# EAGLE design controller_board_minimal (EAGLE 9.0.0)
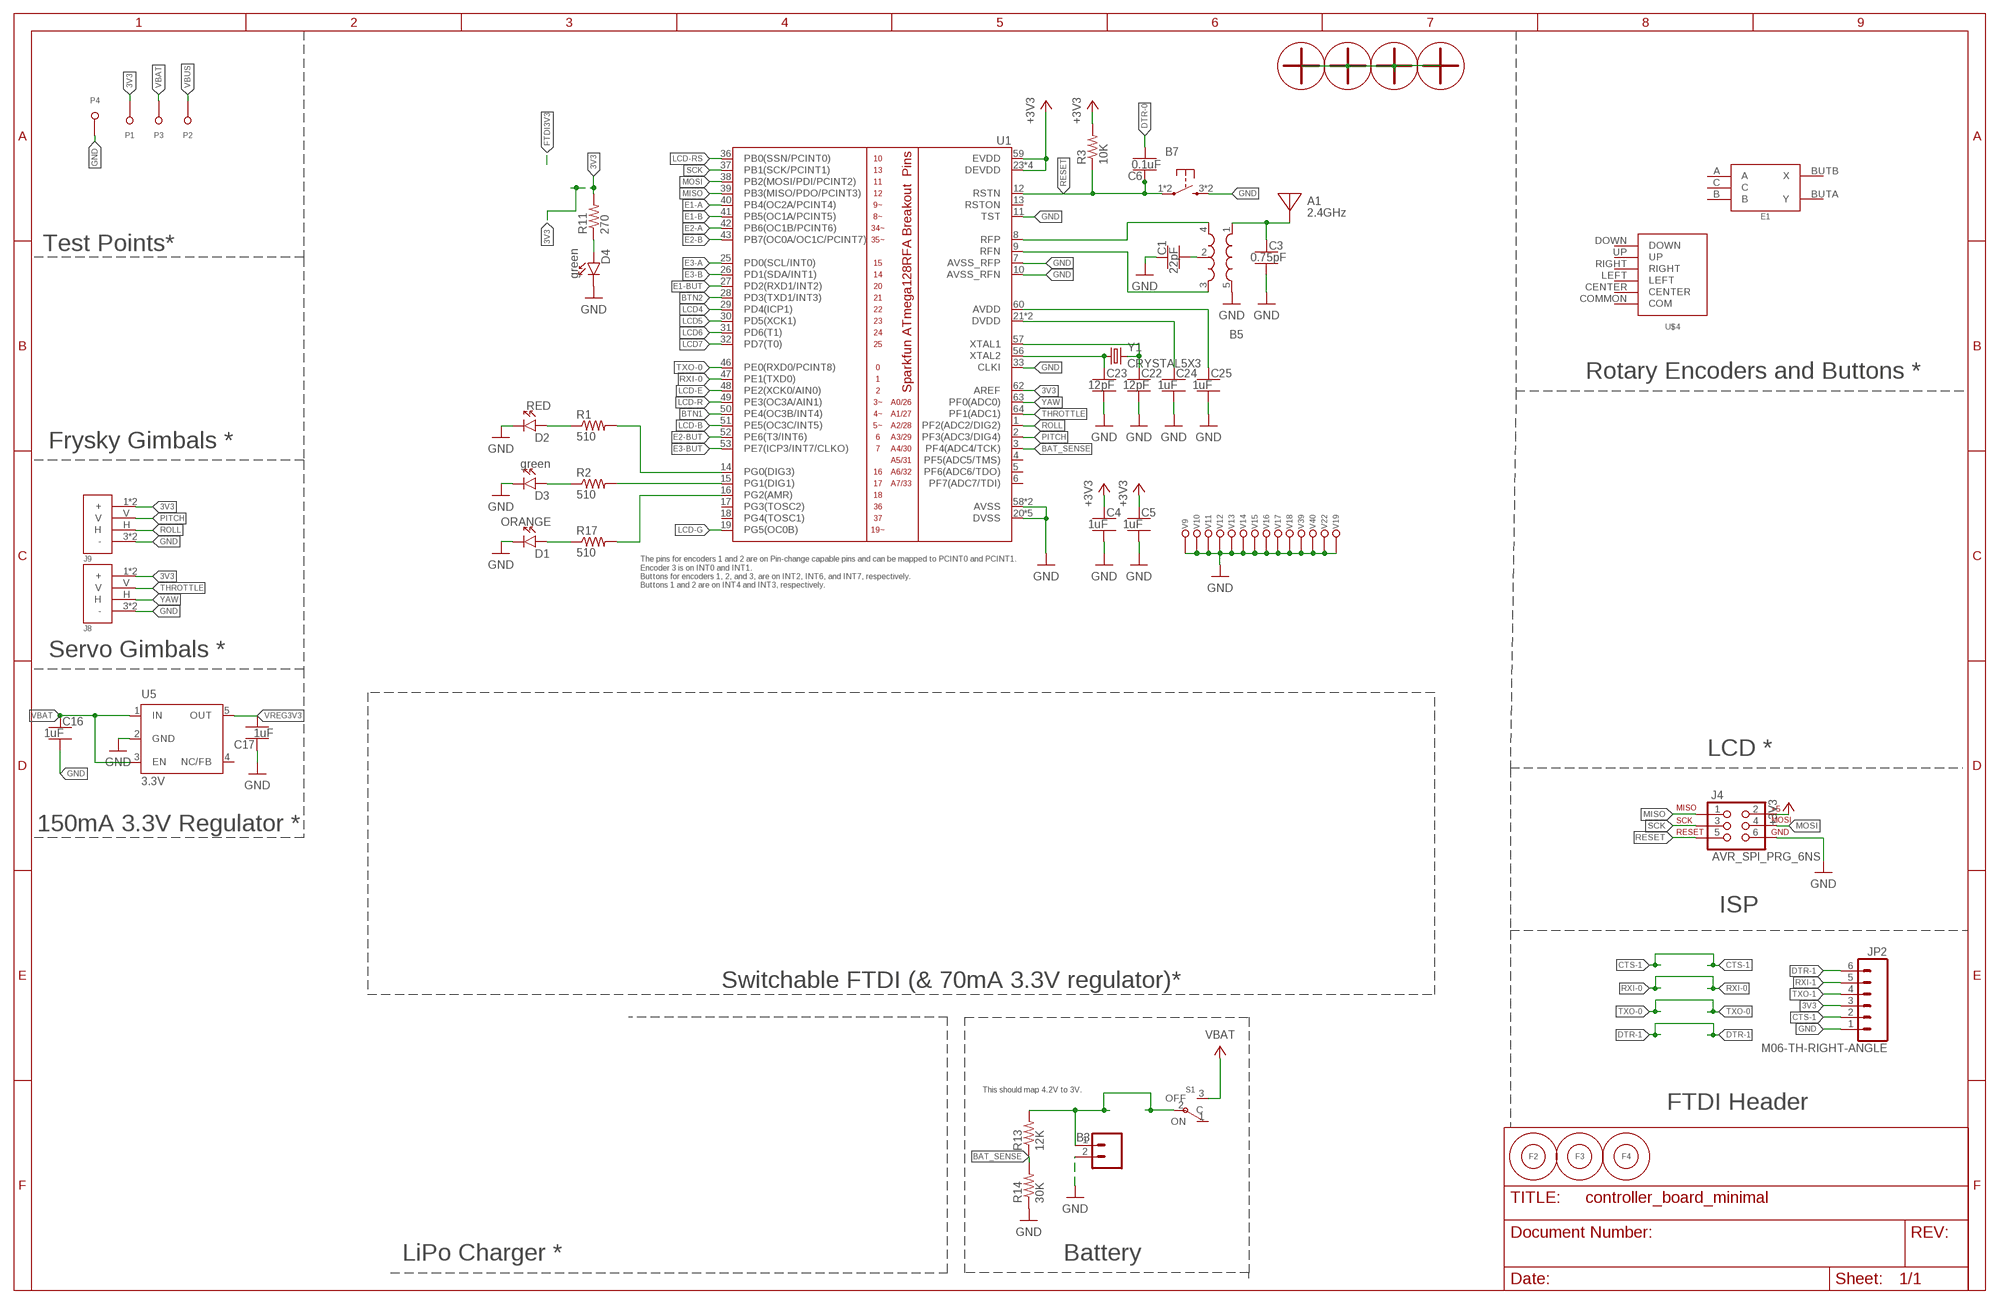
[diagram p0: schematic, sheet 1]
FRAME1 (FRAME_B_L): CREATOR: Unknown; DIST: Unknown; DISTPN: Unknown

## Parts
A1  2.4GHz  ANTENNA_PCBNRF8001_1.6MM  [ANT_PCB_2.4GHZ_NRF8001_1.6MM_1OZ]
B3  HEADER-0.1IN-2POS-SCREW  [SCREW-TERMINAL-1X2-2.54MM]
B5  BALUN0805  [BALUN]
B7  PUSHBUTTON_SMD-VERTICAL-1  [TE_FSM8JSMA_HS]
C1  22pF  CAPACITOR-NP_SMD-2012-0805_CERAMIC-22PF  [CAPC2012X140_HS]
C3  0.75pF  CAPACITOR-NP_SMD-2012-0805_CERAMIC-0.75PF  [CAPC2012X140_HS]
C4  1uF  CAPACITOR-NP_SMD-2012-0805_CERAMIC-1UF  [CAPC2012X140_HS]
C5  1uF  CAPACITOR-NP_SMD-2012-0805_CERAMIC-1UF  [CAPC2012X140_HS]
C6  0.1uF  CAPACITOR-NP_SMD-2012-0805_CERAMIC-0.1UF  [CAPC2012X140_HS]
C16  1uF  CAPACITOR-NP_SMD-2012-0805_CERAMIC-1UF  [CAPC2012X140_HS]
C17  1uF  CAPACITOR-NP_SMD-2012-0805_CERAMIC-1UF  [CAPC2012X140_HS]
C22  12pF  CAPACITOR-NP_SMD-2012-0805_CERAMIC-12PF  [CAPC2012X140_HS]
C23  12pF  CAPACITOR-NP_SMD-2012-0805_CERAMIC-12PF  [CAPC2012X140_HS]
C24  1uF  CAPACITOR-NP_SMD-2012-0805_CERAMIC-1UF  [CAPC2012X140_HS]
C25  1uF  CAPACITOR-NP_SMD-2012-0805_CERAMIC-1UF  [CAPC2012X140_HS]
D1  ORANGE  DIODE-LED_SMD-2012-0805-ORANGE  [LEDSC125X200X120-2_HS]
D2  RED  DIODE-LED_SMD-2012-0805-RED  [LEDSC125X200X120-2_HS]
D3  green  DIODE-LED_SMD-2012-0805-GREEN  [LEDSC125X200X120-2_HS]
D4  green  DIODE-LED_SMD-2012-0805-GREEN  [LEDSC125X200X120-2_HS]
E1  ROTARY-ENCODER-W/BUTTON-BOURNS-PEC12R-30MM  [BOURNS-PEC12R]
F2  1mm  FIDUCIAL-STENCIL  [FIDUCIAL_STENCIL]
F3  1mm  FIDUCIAL-STENCIL  [FIDUCIAL_STENCIL]
F4  1mm  FIDUCIAL-STENCIL  [FIDUCIAL_STENCIL]
J4  AVR_SPI_PRG_6NS  [2X3-NS]
J8  FRSKY-GIMBAL-2X-SERVO  [2X-GIMBAL-SERVO]
J9  FRSKY-GIMBAL-2X-SERVO  [2X-GIMBAL-SERVO]
JP2  M06-TH-RIGHT-ANGLE  [1X06-SIP-RIGHT-ANGLE]
P1  TEST-POINT  [TEST-POINT-KEYSTONE-5000]
P2  TEST-POINT  [TEST-POINT-KEYSTONE-5000]
P3  TEST-POINT  [TEST-POINT-KEYSTONE-5000]
P4  TEST-POINT  [TEST-POINT-KEYSTONE-5000]
R1  510  RESISTOR_SMD-2012-0805-510  [RESC2012X60_HS]
R2  510  RESISTOR_SMD-2012-0805-510  [RESC2012X60_HS]
R3  10K  RESISTOR_SMD-2012-0805-10K  [RESC2012X60_HS]
R11  270  RESISTOR_SMD-2012-0805-270  [RESC2012X60_HS]
R13  12K  RESISTOR_SMD-2012-0805-12K  [RESC2012X60_HS]
R14  30K  RESISTOR_SMD-2012-0805-30K  [RESC2012X60_HS]
R17  510  RESISTOR_SMD-2012-0805-510  [RESC2012X60_HS]
S1  POWER-SWITCH-MFS201N-9-Z-SMD-VERTICAL  [JS102011JCQN]
U1  ATMEGA128RFA1  [QFN-64]
U5  3.3V  TPS73633-DBVT3V3  [SOT23-DBV]
U$1  MOUNTING-HOLE-M2.5-GROUNDED  [M2.5-MOUNTING-HOLE]
U$2  MOUNTING-HOLE-M2.5-GROUNDED  [M2.5-MOUNTING-HOLE]
U$3  MOUNTING-HOLE-M2.5-GROUNDED  [M2.5-MOUNTING-HOLE]
U$4  NAV-SWITCH  [NAV-SWITCH-JS5208]
U$6  MOUNTING-HOLE-M2.5-GROUNDED  [M2.5-MOUNTING-HOLE]
V9  LOCKED-VIA-0.2  [VIA-0.2MM]
V10  LOCKED-VIA-0.2  [VIA-0.2MM]
V11  LOCKED-VIA-0.2  [VIA-0.2MM]
V12  LOCKED-VIA-0.2  [VIA-0.2MM]
V13  LOCKED-VIA-0.2  [VIA-0.2MM]
V14  LOCKED-VIA-0.2  [VIA-0.2MM]
V15  LOCKED-VIA-0.2  [VIA-0.2MM]
V16  LOCKED-VIA-0.2  [VIA-0.2MM]
V17  LOCKED-VIA-0.2  [VIA-0.2MM]
V18  LOCKED-VIA-0.2  [VIA-0.2MM]
V19  LOCKED-VIA-0.2  [VIA-0.2MM]
V22  LOCKED-VIA-0.2  [VIA-0.2MM]
V39  LOCKED-VIA-0.2  [VIA-0.2MM]
V40  LOCKED-VIA-0.2  [VIA-0.2MM]
Y1  CRYSTAL5X3  [CRYSTAL-SMD-5X3]

## Nets
3V3 [HIGH-I]: C4.1 C5.1 J4.2 J8.1(+) J8.4(+) J9.1(+) J9.4(+) JP2.3 P1.T R3.2 R11.2 U1.23(DEVDD) U1.34(DEVDD) U1.44(DEVDD) U1.54(DEVDD) U1.59(EVDD) U1.62(AREF) ; supply symbol labelled +3V3
ANTENNA [RFSIG]: A1.FEED B5.1(IN) C3.1
BAT_SENSE: R13.1 R14.2 U1.3(PF4(ADC4/TCK))
BPOS [HIGH-I]: B3.1 R13.2 S1.2(C)
BTN1: U1.50(PE4(OC3B/INT4))
BTN2: U1.28(PD3(TXD1/INT3))
CTS-1: JP2.2
DTR-0: C6.2
DTR-1: JP2.6
E1-A: U1.40(PB4(OC2A/PCINT4))
E1-B: U1.41(PB5(OC1A/PCINT5))
E1-BUT: U1.27(PD2(RXD1/INT2))
E2-A: U1.42(PB6(OC1B/PCINT6))
E2-B: U1.43(PB7(OC0A/OC1C/PCINT7))
E2-BUT: U1.52(PE6(T3/INT6))
E3-A: U1.25(PD0(SCL/INT0))
E3-B: U1.26(PD1(SDA/INT1))
E3-BUT: U1.53(PE7(ICP3/INT7/CLKO))
GND [HIGH-I]: B3.2 B5.5(GND) B7.3 B7.4 C1.1 C3.2 C4.2 C5.2 C16.2 C17.1 C22.2 C23.2 C24.2 C25.2 D1.1(C) D2.2(C) D3.1(C) D4.1(C) J4.6 J8.3(-) J8.6(-) J9.3(-) J9.6(-) JP2.1 P4.T R14.1 U1.7(AVSS_RFP) U1.10(AVSS_RFN) U1.11(TST) U1.20(DVSS) U1.24(DVSS) U1.33(CLKI) U1.35(DVSS) U1.45(DVSS) U1.55(DVSS) U1.58(AVSS) U1.61(AVSS) U5.2(GND) U$1.P$1 U$1.P$2 U$1.P$3 U$1.P$4 U$1.P$6 U$1.P$7 U$1.P$8 U$1.P$9 U$2.P$1 U$2.P$2 U$2.P$3 U$2.P$4 U$2.P$6 U$2.P$7 U$2.P$8 U$2.P$9 U$6.P$1 U$6.P$2 U$6.P$3 U$6.P$4 U$6.P$6 U$6.P$7 U$6.P$8 U$6.P$9 V9.P1(N) V10.P1(N) V11.P1(N) V12.P1(N) V13.P1(N) V14.P1(N) V15.P1(N) V16.P1(N) V17.P1(N) V18.P1(N) V19.P1(N) V22.P1(N) V39.P1(N) V40.P1(N)
LCD4: U1.29(PD4(ICP1))
LCD5: U1.30(PD5(XCK1))
LCD6: U1.31(PD6(T1))
LCD7: U1.32(PD7(T0))
LCD-B: U1.51(PE5(OC3C/INT5))
LCD-E: U1.48(PE2(XCK0/AIN0))
LCD-G: U1.19(PG5(OC0B))
LCD-R: U1.49(PE3(OC3A/AIN1))
LCD-RS: U1.36(PB0(SSN/PCINT0))
MISO: J4.1 U1.39(PB3(MISO/PDO/PCINT3))
MOSI: J4.4 U1.38(PB2(MOSI/PDI/PCINT2))
N$1: D1.2(A) R17.1
N$4: R2.2 U1.15(PG1(DIG1))
N$7: B5.2(GND) C1.2
N$8: R1.2 U1.14(PG0(DIG3))
N$9: D2.1(A) R1.1
N$10: D3.2(A) R2.1
N$14: D4.2(A) R11.1
N$15: C22.1 U1.57(XTAL1) Y1.3
N$16: R17.2 U1.16(PG2(AMR))
N$19: C23.1 U1.56(XTAL2) Y1.1
N$20: C24.1 U1.21(DVDD) U1.22(DVDD)
N$21: C25.1 U1.60(AVDD)
PITCH: J9.V U1.2(PF3(ADC3/DIG4))
RESET: B7.1 B7.2 C6.1 J4.5 R3.1 U1.12(RSTN)
RFN: B5.3(OUT2) U1.9(RFN)
RFP: B5.4(OUT1) U1.8(RFP)
ROLL: J9.H U1.1(PF2(ADC2/DIG2))
RXI-0: U1.47(PE1(TXD0))
RXI-1: JP2.5
SCK: J4.3 U1.37(PB1(SCK/PCINT1))
THROTTLE: J8.V U1.64(PF1(ADC1))
TXO-0: U1.46(PE0(RXD0/PCINT8))
TXO-1: JP2.4
VBAT [HIGH-I]: C16.1 P3.T S1.3(OFF) U5.1(IN) U5.3(EN)
VBUS [HIGH-I]: P2.T
VREG3V3 [HIGH-I]: C17.2 U5.5(OUT)
YAW: J8.H U1.63(PF0(ADC0))
Unconnected: E1.A E1.B E1.BUTA(Y) E1.BUTB(X) E1.C S1.1(ON) U1.4(PF5(ADC5/TMS)) U1.5(PF6(ADC6/TDO)) U1.6(PF7(ADC7/TDI)) U1.13(RSTON) U1.17(PG3(TOSC2)) U1.18(PG4(TOSC1)) U5.4(NC/FB) U$3.P$1 U$3.P$2 U$3.P$3 U$3.P$4 U$3.P$6 U$3.P$7 U$3.P$8 U$3.P$9 U$4.CENTER U$4.COMMON(COM) U$4.DOWN U$4.LEFT U$4.RIGHT U$4.UP

## Notes on the sheet
- Test Points*
- Rotary Encoders and Buttons *
- Frysky Gimbals *
- The pins for encoders 1 and 2 are on Pin-change capable pins and can be mapped to PCINT0 and PCINT1.
  Encoder 3 is on INT0 and INT1.
  Buttons for encoders 1, 2, and 3, are on INT2, INT6, and INT7, respectively.
  Buttons 1 and 2 are on INT4 and INT3, respectively.
- Servo Gimbals *
- LCD *
- 150mA 3.3V Regulator *
- ISP
- Switchable FTDI (& 70mA 3.3V regulator)*
- This should map 4.2V to 3V.
- FTDI Header
- LiPo Charger * | Battery

## Library data of the parts
A1 = RemoteParts:ANTENNA_PCB: Various pre-calculated PCB Antennas NRF8001 1.6mm 1Oz - 2.4GHz PCB antenna for 1.6mm PCBs with 1oz copper, double-sided boards (no GND plan beneath antenna). See nRF2740 production files for further information and impedance matching network. 868MHz/2.4GHz DUALBAND - Dual 868MHz and 2.4GHz centered antenna based on board #6 of the CC-ANTENNA-DK from Chipcon/TI
B3 = RemoteParts:HEADER-0.1IN-2POS: 2 pin single inline pin header, socket, or connector; DIST: digikey; DISTPN: ED10561-ND; PIN1: +; PIN2: -
B5 = quadparts_prebuilt:BALUN: 0805 footprint balun- Ember 351/357; CREATOR: Swanson; DATASHEET: http://katalog.we-online.de/pbs/datasheet/748421245.pdf; DIST: Digikey; DISTPN: 732-2230-6-ND; MFR: Wurth Electronics Inc; MPN: 748421245; PRICE: 2.63; REVIEWER: Swanson
B7 = quadparts_prebuilt:PUSHBUTTON_: Pushbutton with 2 pins shorting 1 to 2 and two extra mounting pins 3 & 4; CREATOR: Swanson; DIST: Digikey; DISTPN: 450-1129-ND; MFR: TE Connectivity Alcoswitch Switches; MPN: FSM4JSMA; REVIEWER: Swanson
C1 = quadparts_prebuilt:CAPACITOR-NP_: Nonpolarized capacitor; CREATOR: Swanson; DIST: Digikey; DISTPN: 490-5534-1-ND; MFR: Murata Electronics North America; MPN: GRM21A5C2E220JW01D; REVIEWER: Swanson
C3 = quadparts_prebuilt:CAPACITOR-NP_: Nonpolarized capacitor; CREATOR: Swanson; DIST: Digikey; DISTPN: 490-3585-1-ND; MFR: Murata Electronics North America; MPN: GQM2195C2AR75CB01D; REVIEWER: Swanson
C4 C5 C16 C17 C24 C25 = quadparts_prebuilt:CAPACITOR-NP_: Nonpolarized capacitor; CREATOR: Swanson; DIST: Digikey; DISTPN: 587-1281-1-ND; MFR: Taiyo Yuden; MPN: TMK212B7105KG-T; REVIEWER: Swanson
C6 = quadparts_prebuilt:CAPACITOR-NP_: Nonpolarized capacitor; CREATOR: Swanson; DIST: Digikey; DISTPN: 445-1418-1-ND; MFR: TDK; MPN: C2012X7R2A104K125AA; REVIEWER: Swanson
C22 C23 = quadparts_prebuilt:CAPACITOR-NP_: Nonpolarized capacitor; CREATOR: Swanson; DIST: Digikey; DISTPN: 490-5531-1-ND; MFR: Murata Electronics North America; MPN: GRM21A5C2E120JW01D; REVIEWER: Swanson
D1 = RemoteParts:DIODE-LED_: Light emitting diode; CREATOR: Swanson; DIST: DIGIKEY; DISTPN: 160-1177-1-ND
D2 = RemoteParts:DIODE-LED_: Light emitting diode; CREATOR: Swanson; DIST: DIGIKEY; DISTPN: 160-1176-1-ND
D3 D4 = RemoteParts:DIODE-LED_: Light emitting diode; CREATOR: Swanson; DIST: Digikey; DISTPN: 160-1179-1-ND; MFR: Lite-On Inc; MPN: LTST-C170GKT; REVIEWER: Swanson
E1 = RemoteParts:ROTARY-ENCODER-W/BUTTON; AUX1DIST: DIGIKEY; AUX1DISTPN: 1722-1241-ND; CREATOR: Swanson; DIST: DIGIKEY; DISTPN: PEC12R-4030F-S0024-ND
F2-F4 = RemoteParts:FIDUCIAL; CREATOR: Swanson; DIST: NA; DISTPN: NA
J4 = quadparts_prebuilt:AVR_SPI_PRG_6: AVR ISP 6 Pin This is the reduced ISP connector for AVR programming. Common on Arduino. This footprint will take up less PCB space and can be used with a 10-pin to 6-pin adapter such as SKU: BOB-08508; CREATOR: Swanson; DATASHEET: http://portal.fciconnect.com/Comergent//fci/drawing/67996.pdf; DIST: Digikey; DISTPN: 609-3234-ND; MFR: Amphenol FCI; MPN: 67997-206HLF; PRICE: 0.31; REVIEWER: Swanson
J8 J9 = RemoteParts:FRSKY-GIMBAL; CREATOR: Swanson; DIST: DIGIKEY; DISTPN: 609-3327-ND
JP2 = RemoteParts:M06: Header 6 Standard 6-pin 0.1" header. Use with straight break away headers (SKU : PRT-00116), right angle break away headers (PRT-00553), swiss pins (PRT-00743), machine pins (PRT-00117), and female headers (PRT-00115). Molex polarized connector foot print use with SKU : PRT-08094 with associated crimp pins and housings. NOTES ON THE VARIANTS LOCK and LOCK_LONGPADS... This footprint was designed to help hold the alignment of a through-hole component (i.e. 6-pin header) while soldering it into place. You may notice that each hole has been shifted either up or down by 0.005 of an inch from it's more standard position (which is a perfectly straight line). This slight alteration caused the pins (the squares in the middle) to touch the edges of the holes. Because they are alternating, it causes a "brace" to hold the component in place. 0.005 has proven to be the perfect amount of "off-center" position when using our standard breakaway headers. Although looks a little odd when you look at the bare footprint, once you have a header in there, the alteration is very hard to notice. Also, if you push a header all the way into place, it is covered up entirely on the bottom side. This idea of altering the position of holes to aid alignment will be further integrated into the Sparkfun Library for other footprints. It can help hold any component with 3 or more connection pins.; CREATOR: Swanson; DIST: DIGIKEY; DISTPN: 609-3327-ND
P1-P4 = RemoteParts:TEST-POINT; CREATOR: Swanson; DIST: DIGIKEY; DISTPN: 36-5001-ND
R1 R2 R17 = quadparts_prebuilt:RESISTOR_: Resistor; DIST: DIGIKEY; DISTPN: 311-510ARCT-ND
R3 = quadparts_prebuilt:RESISTOR_: Resistor; CREATOR: Swanson; DIST: Digikey; DISTPN: 311-10KARCT-ND; MFR: Yageo; MPN: RC0805JR-0710KL; REVIEWER: Swanson
R11 = quadparts_prebuilt:RESISTOR_: Resistor; DIST: DIGIKEY; DISTPN: 311-270ARCT-ND
R13 = quadparts_prebuilt:RESISTOR_: Resistor; CREATOR: Swanson; DIST: DIGIKEY; DISTPN: YAG3692CT-ND
R14 = quadparts_prebuilt:RESISTOR_: Resistor; CREATOR: Swanson; DIST: DIGIKEY; DISTPN: YAG3721CT-ND
S1 = RemoteParts:POWER-SWITCH-MFS201N-9-Z; CREATOR: Swanson; DIST: DIGIKEY; DISTPN: CKN10721CT-ND
U1 = quadparts_prebuilt:ATMEGA128RFA1: ATmega128RFA1 8-bit AVR Microcontroller with Low Power 2.4GHz Transceiver for ZigBee and IEEE 802.15.4; CREATOR: Swanson; DATASHEET: http://www.atmel.com/Images/Atmel-8266-MCU_Wireless-ATmega128RFA1_Datasheet.pdf; DIST: Digikey; DISTPN: ATMEGA128RFA1-ZU-ND; MFR: Atmel; MPN: ATMEGA128RFA1-ZUR00; PRICE: 10.21; REVIEWER: Swanson
U5 = quadparts_prebuilt:TPS73633-DBVT; CREATOR: Swanson; DIST: DIGIKEY; DISTPN: LP3985IM5-3.3/NOPBCT-ND
U$1-U$3 U$6 = RemoteParts:MOUNTING-HOLE
U$4 = RemoteParts:NAV-SWITCH; AUX1DIST: Digikey; AUX1DISTPN: EG1091-ND; CREATOR: Swanson; DIST: DIGIKEY; DISTPN: EG4561-ND
V9-V19 V22 V39 V40 = quadparts_prebuilt:LOCKED-VIA; CREATOR: Swanson; DIST: NA; DISTPN: NA
Y1 = quadparts_prebuilt:CRYSTAL: Various standard crystals. Proven footprints.; CREATOR: Swanson; DATASHEET: http://www.abracon.com/Resonators/abm3b.pdf; DIST: Digikey; DISTPN: 535-9122-1-ND; MFR: Abracon LLC; MPN: ABM3B-16.000MHZ-B2-T; PRICE: 0.68; PROD_ID: XTAL-08218; REVIEWER: Swanson

## Net classes
1 HIGH-I: width 0.254 mm
2 RFSIG: width 1.016 mm

## Board
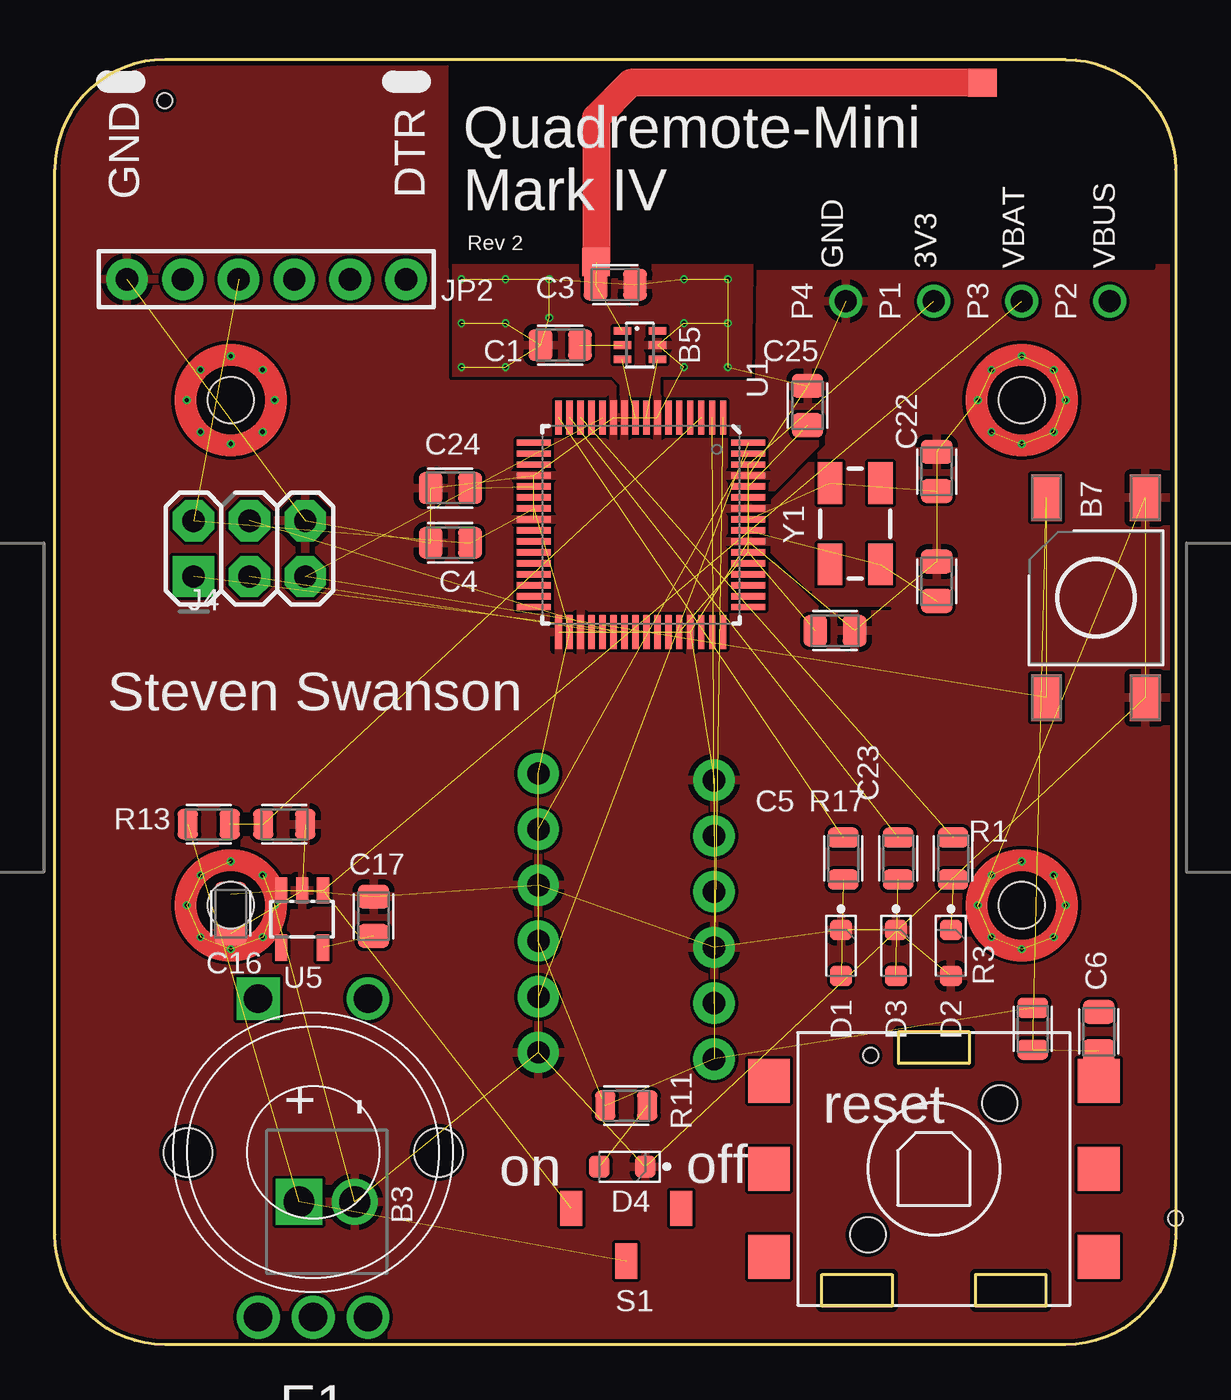
[diagram p1: board, top side]
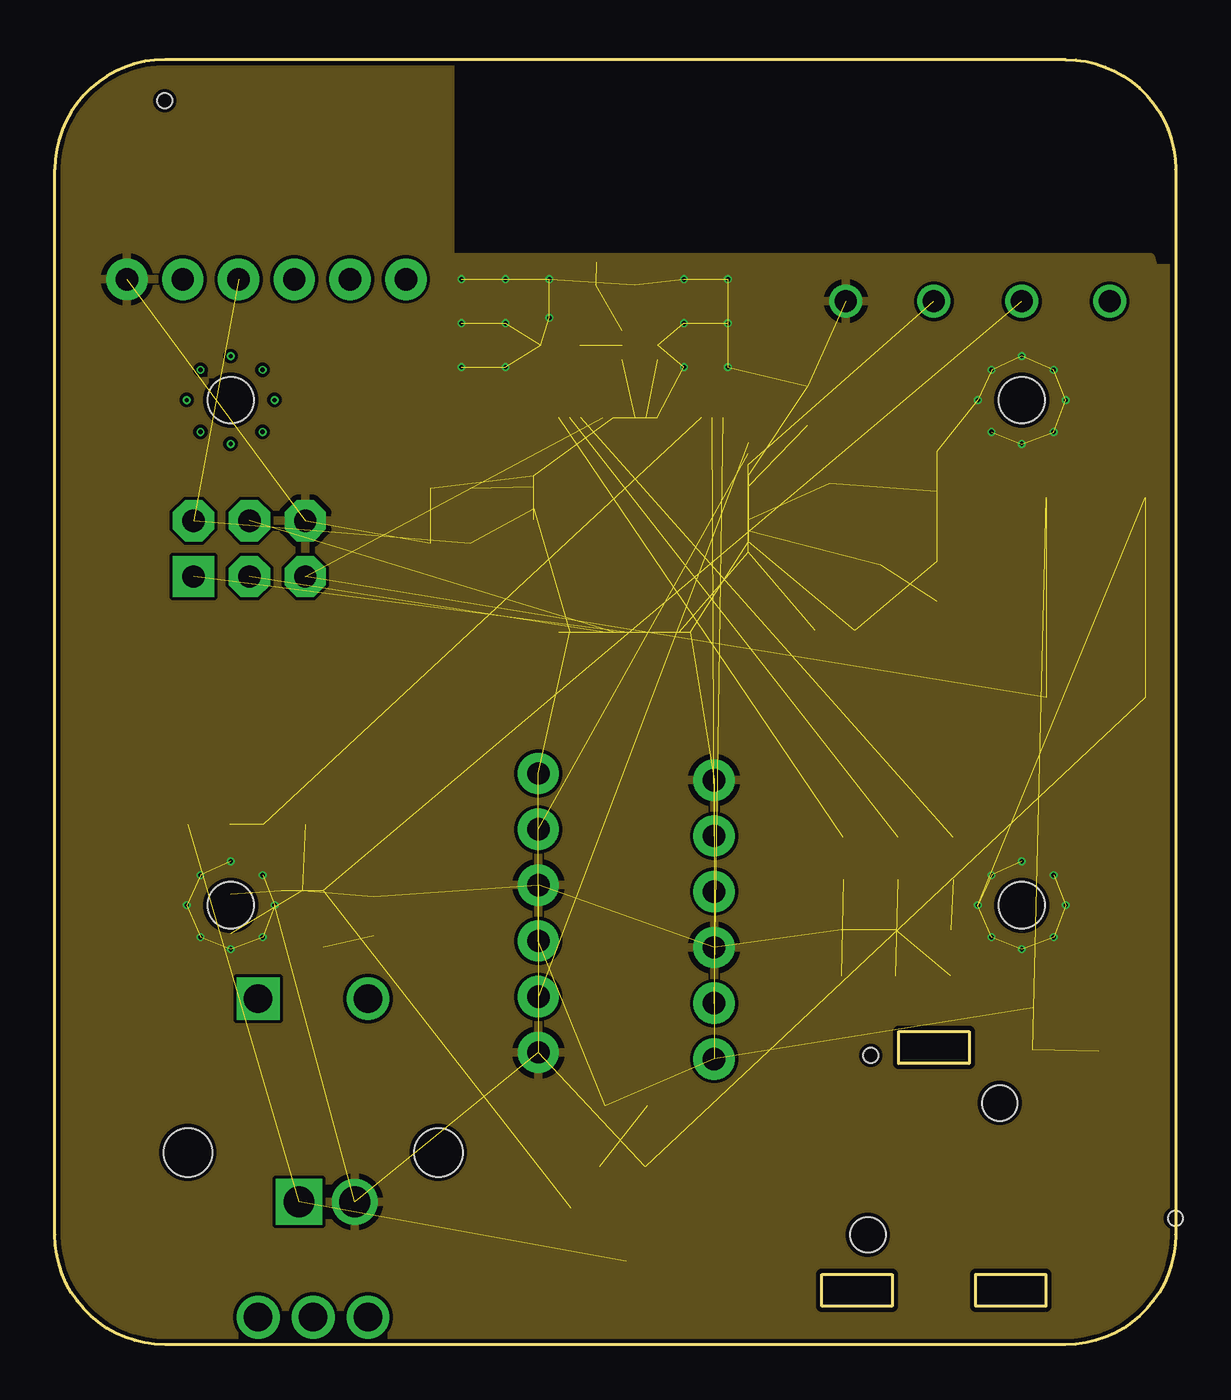
[diagram p2: board, inner layer Route2]
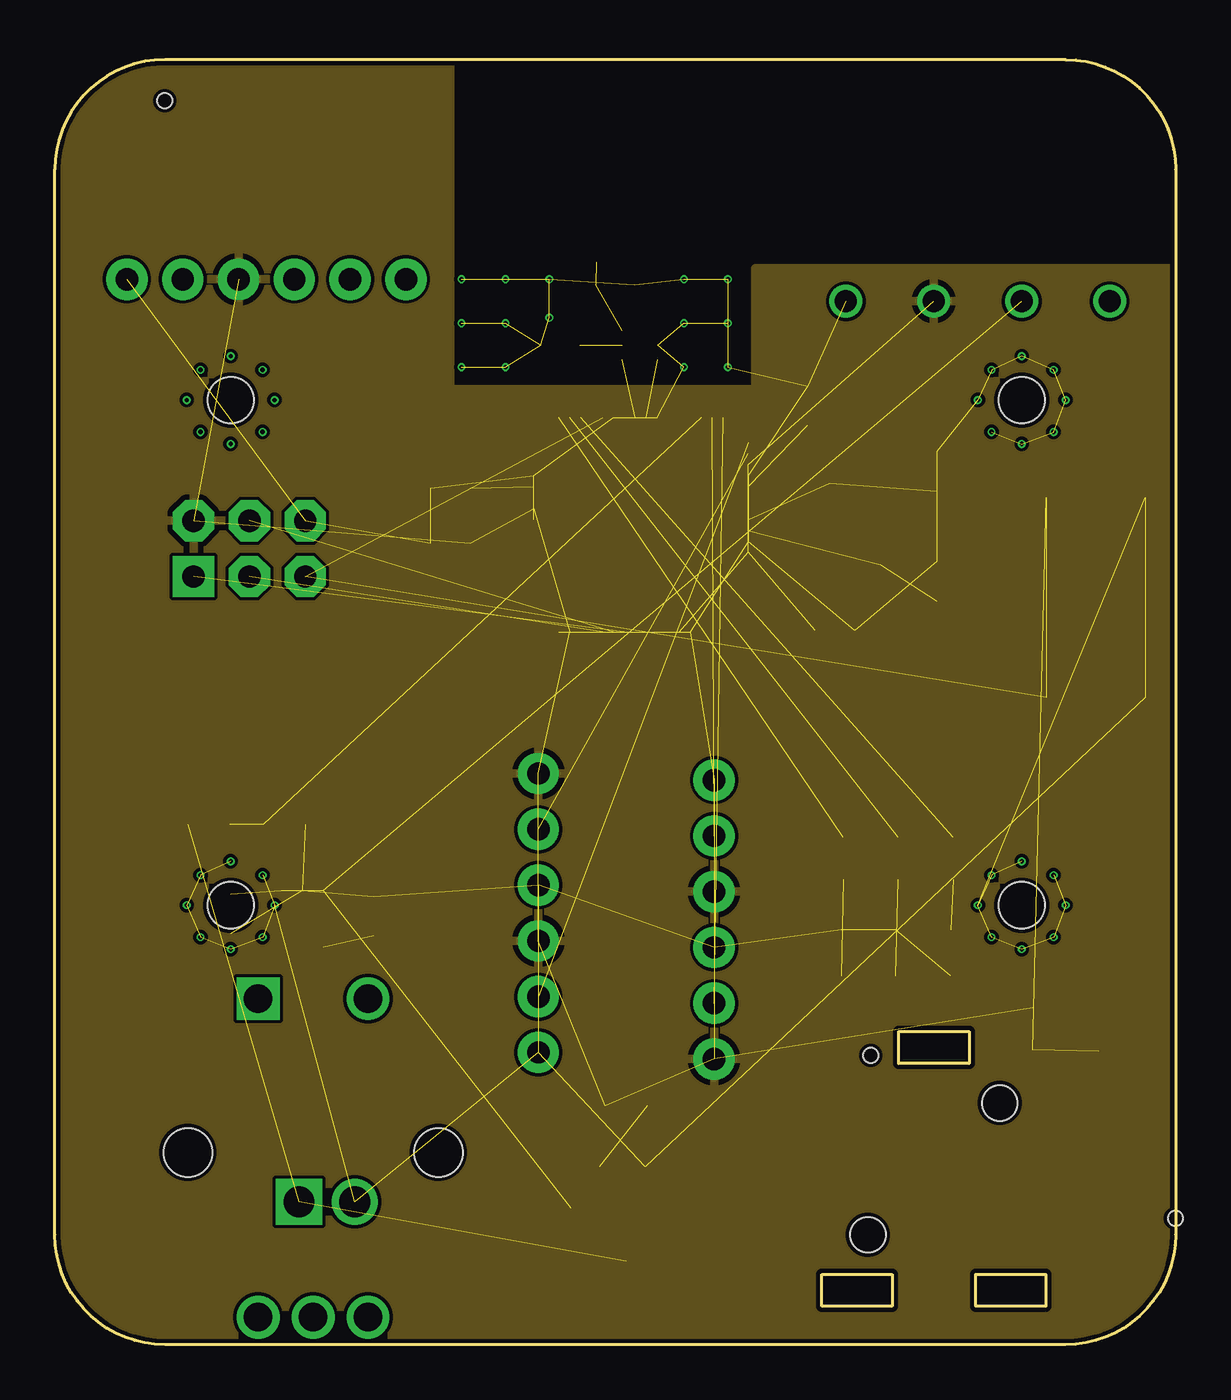
[diagram p3: board, inner layer Route15]
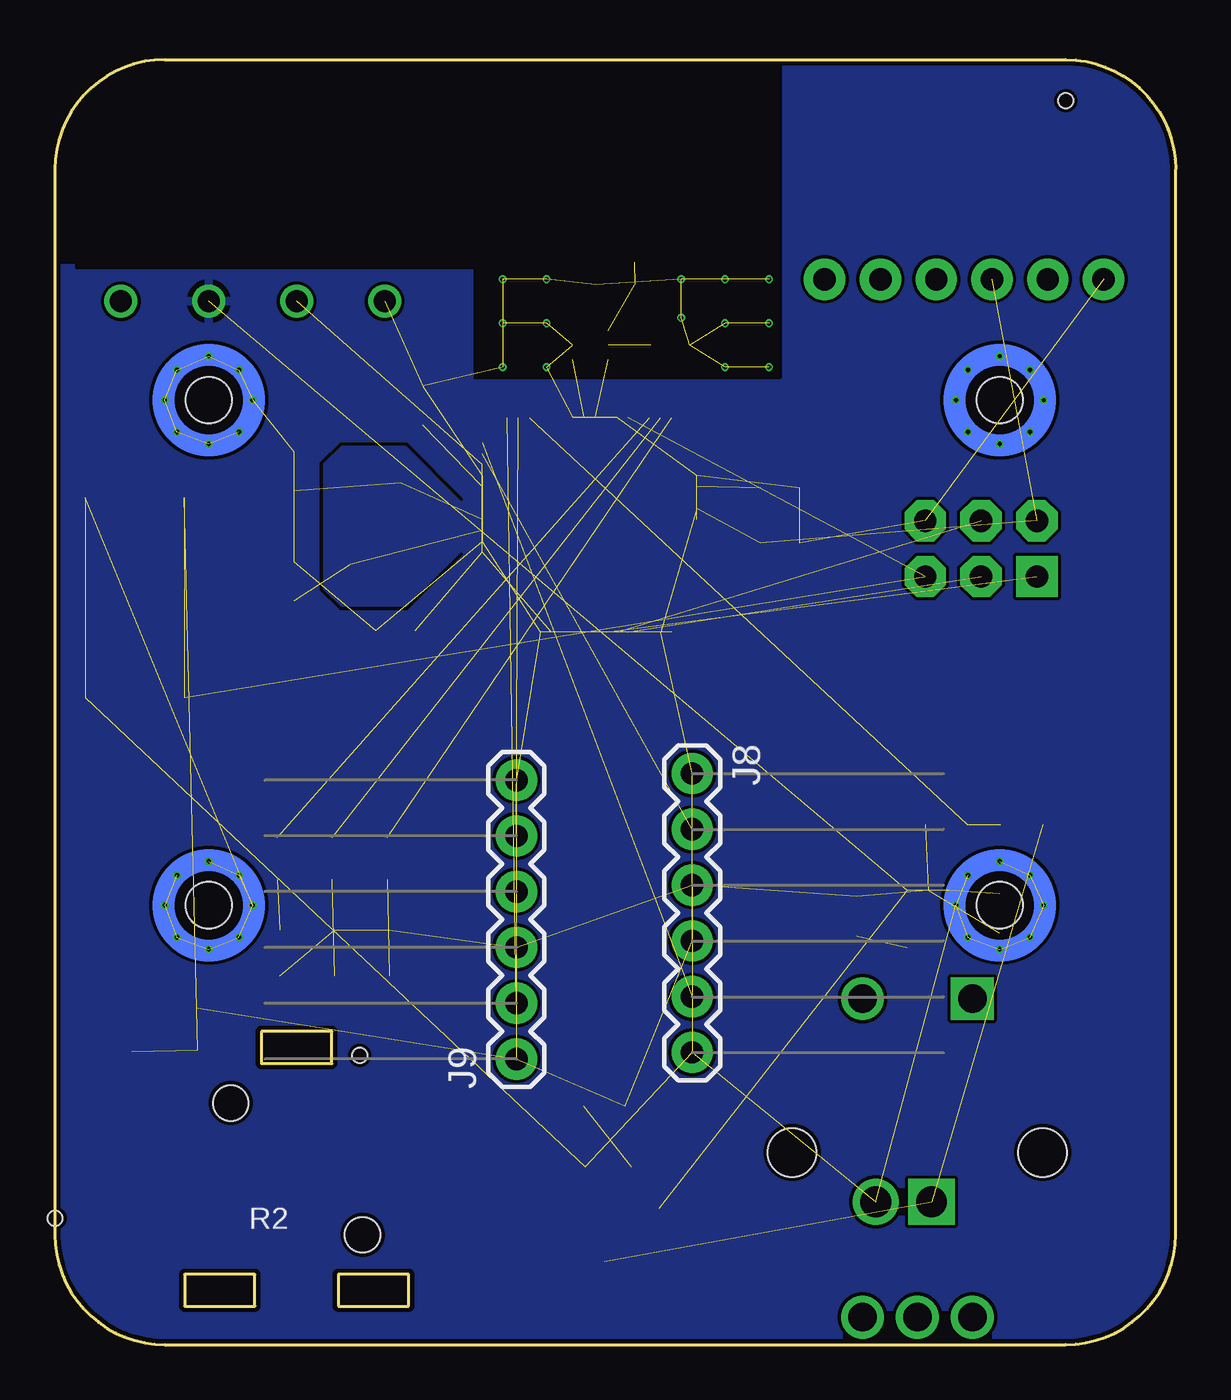
[diagram p4: board, bottom side, seen from below]

Size 51 x 58.5 mm. Coordinates in mm from the lower left corner, seen from the top.
Outline: 51,53.5 51,5 arc-90 46,0 5,0 arc-90 0,5 0,53.5 arc-90 5,58.5 46,58.5 arc-90 51,53.5
Copper layers (1*2*15*16): Top 0.035559375mm / dielectric 1.501140625mm / Route2 0.035559375mm / dielectric 0.149859375mm / Route15 0.035559375mm / dielectric 0.200659375mm / Bottom 0.035559375mm
Design rules "jlcpcb-4layer-6mil *": minimum track width 6mil, minimum drill 0.2mm, track to track 6mil, track to pad 6mil, pad to pad 6mil, via to via 6mil, smd to smd 5mil, copper to edge 0.2mm, drill to drill 10mil, minimum pad ring 3mil, minimum via ring 5mil, stop-mask expansion 3mil, vias tented up to drill 0.2mm, thermal gap 10mil
tRestrict: 14 lines
bRestrict: 15 lines

### Footprints (pad centres in the part's own frame; a part is rotated, then mirrored left to right if it is on the bottom)
ANT_PCB_2.4GHZ_NRF8001_1.6MM_1OZ = smd 1.27 x 1.27: FEED 0,0; TESTPOINT -8.169,17.605
SCREW-TERMINAL-1X2-2.54MM = drill 1.4 pad 1.778 square: 1 -1.27,0 | drill 1.4 pad 1.778: 2 1.27,0
BALUN = smd 0.35 x 0.8: 1 -0.65,-0.8; 2 0,-0.8; 3 0.65,-0.8; 4 0.65,0.8; 5 0,0.8; 6 -0.65,0.8
TE_FSM8JSMA_HS = smd 1.4 x 2.1: 1 -2.25,4.55; 2 -2.25,-4.55; 3 2.25,4.55; 4 2.25,-4.55
CAPC2012X140_HS = smd 1.08 x 1.42: 1 -0.895,0; 2 0.895,0
LEDSC125X200X120-2_HS = smd 0.94 x 0.99: 1 1.745,-0.9; 2 -0.345,-0.9
BOURNS-PEC12R = drill 1.3: A -2.5,-7.5; B 2.5,-7.5; BUTB 2.5,7; C 0,-7.5 | drill 1.3 square: BUTA -2.5,7 | hole 2.2: -5.7,0; 5.7,0
FRSKY-TARANIS-GIMBAL = hole 2.8: -27,27; -27,-27; 27,-27; 27,27
FIDUCIAL_STENCIL = hole 0.66: 0,0
2X3-NS = drill 1.016 pad 1.88 square: 1 -2.54,-1.27 | drill 1.016 pad 1.88 octagon: 2 -2.54,1.27; 3 0,-1.27; 4 0,1.27; 5 2.54,-1.27; 6 2.54,1.27
2X-GIMBAL-SERVO = drill 1.016 pad 1.88: 1 0,0; 3 5.08,0; 4 7.62,0; 6 12.7,0; H 2.54,0; V 10.16,0
1X06-SIP-RIGHT-ANGLE = drill 1.016 pad 1.88: 1 -6.35,0; 2 -3.81,0; 3 -1.27,0; 4 1.27,0; 5 3.81,0; 6 6.35,0
TEST-POINT-KEYSTONE-5000 = drill 1: T 0,0
RESC2012X60_HS = smd 0.92 x 1.38: 1 -0.955,0; 2 0.955,0
JS102011JCQN = smd 1 x 1.6: 1 -2.5,-1.2; 2 0,1.2; 3 2.5,-1.2
QFN-64 = smd 1.562 x 0.28: 1 -4.881,3.75; 2 -4.881,3.25; 3 -4.881,2.75; 4 -4.881,2.25; 5 -4.881,1.75; 6 -4.881,1.25; 7 -4.881,0.75; 8 -4.881,0.25; 9 -4.881,-0.25; 10 -4.881,-0.75; 11 -4.881,-1.25; 12 -4.881,-1.75; 13 -4.881,-2.25; 14 -4.881,-2.75; 15 -4.881,-3.25; 16 -4.881,-3.75; 33 4.881,-3.75; 34 4.881,-3.25; 35 4.881,-2.75; 36 4.881,-2.25; 37 4.881,-1.75; 38 4.881,-1.25; 39 4.881,-0.75; 40 4.881,-0.25; 41 4.881,0.25; 42 4.881,0.75; 43 4.881,1.25; 44 4.881,1.75; 45 4.881,2.25; 46 4.881,2.75; 47 4.881,3.25; 48 4.881,3.75 | smd 0.28 x 1.562: 17 -3.75,-4.881; 18 -3.25,-4.881; 19 -2.75,-4.881; 20 -2.25,-4.881; 21 -1.75,-4.881; 22 -1.25,-4.881; 23 -0.75,-4.881; 24 -0.25,-4.881; 25 0.25,-4.881; 26 0.75,-4.881; 27 1.25,-4.881; 28 1.75,-4.881; 29 2.25,-4.881; 30 2.75,-4.881; 31 3.25,-4.881; 32 3.75,-4.881; 49 3.75,4.881; 50 3.25,4.881; 51 2.75,4.881; 52 2.25,4.881; 53 1.75,4.881; 54 1.25,4.881; 55 0.75,4.881; 56 0.25,4.881; 57 -0.25,4.881; 58 -0.75,4.881; 59 -1.25,4.881; 60 -1.75,4.881; 61 -2.25,4.881; 62 -2.75,4.881; 63 -3.25,4.881; 64 -3.75,4.881
SOT23-DBV = smd 0.55 x 1.2: 1 -0.95,-1.3; 2 0,-1.3; 3 0.95,-1.3; 4 0.95,1.3; 5 -0.95,1.3
M2.5-MOUNTING-HOLE = drill 0.2: P$1 0,2; P$2 0,-2; P$3 2,0; P$4 -2,0; P$6 -1.375,1.375; P$7 1.453,-1.453; P$8 1.453,1.375; P$9 -1.375,-1.453 | hole 2.1: 0,0
NAV-SWITCH-JS5208 = smd 1.9 x 2: CENTER -7.5,-4; COMMON -7.5,4; DOWN 7.5,-4; LEFT -7.5,0; RIGHT 7.5,0; UP 7.5,4 | hole 1.6: 3,3; -3,-3
VIA-0.2MM = drill 0.2 pad 0.3: P1 0,0
CRYSTAL-SMD-5X3 = smd 1.9 x 1.1: 1 -1.85,-1.15; 2 1.85,-1.15; 3 1.85,1.15; 4 -1.85,1.15

### Placement (x,y rotation side)
A1  24.62,49.27 270 top
B3  12.38,6.5 0 top
B5  26.62,45.5 270 top
B7  47.38,34 0 top
C1  23,45.5 0 top
C3  25.5,48.25 0 top
C4  18,36.5 180 top
C5  35.5,32.5 0 top
C6  47.5,14.25 90 top
C16  8,19.62 270 top
C17  14.5,19.5 270 top
C22  40.12,39.75 90 top
C23  40.12,34.75 90 top
C24  18,39 180 top
C25  34.25,42.75 90 top
D1  34.88,17.12 90 top
D2  39.88,17.12 90 top
D3  37.38,17.12 90 top
D4  25.12,9 0 top
E1  11.75,8.75 0 top
E$1  [FRSKY-TARANIS-GIMBAL]  -35.5,29 0 top  (outside the outline)
E$2  [FRSKY-TARANIS-GIMBAL]  86.5,29 180 top  (outside the outline)
F2  37.12,13.16 0 top
F3  5,56.62 0 top
F4  51,5.75 0 top
J4  8.85,36.24 0 top
J8  22,26 270 bottom
J9  30,13 90 bottom
JP2  9.62,48.5 0 top
P1  40,47.5 90 top
P2  48,47.5 90 top
P3  44,47.5 90 top
P4  36,47.5 90 top
R1  40.88,22.12 90 top
R2  38.38,22.12 90 top
R3  44.5,14.38 90 top
R11  26,10.88 180 top
R13  7,23.69 180 top
R14  10.44,23.69 180 top
R17  35.88,22.12 90 top
S1  26,5 180 top
U1  26.67,37.32 270 top
U5  11.25,19.38 180 top
U$1  8,20 0 top
U$2  44,20 0 top
U$3  8,43 0 top
U$4  40,8 0 top
U$6  44,43 0 top
V9  20.5,44.5 0 top
V10  18.5,44.5 0 top
V11  30.62,44.5 0 top
V12  30.62,46.5 0 top
V13  28.62,46.5 0 top
V14  28.62,44.5 0 top
V15  20.5,48.5 0 top
V16  18.5,48.5 0 top
V17  28.62,48.5 0 top
V18  18.5,46.5 0 top
V19  22.5,46.75 0 top
V22  30.62,48.5 0 top
V39  20.5,46.5 0 top
V40  22.5,48.5 0 top
Y1  36.42,37.37 90 top

### Tracks (layer width: path | path; a pad name or v marks a point on that pad's centre or on a via)
3V3  (16 unrouted)
  pour Route15: 18,68 -1.5,68 -1.5,-5 53.5,-5 53.5,49 31.88,49 31.88,43.5 18,43.5
ANTENNA  (2 unrouted)
BAT_SENSE  (2 unrouted)
BPOS  (2 unrouted)
GND  (75 unrouted)
  pour Route2: 18,67.5 -1,67.5 -1,-4.5 53,-4.5 53,49 50,49 49.88,49.5 18,49.5
  pour Top (rank 2): 18,67 -0.5,67 -0.5,-4 52.5,-4 52.5,49 18,49
MISO  (1 unrouted)
MOSI  (1 unrouted)
N$1  (1 unrouted)
N$4  (1 unrouted)
N$7  (1 unrouted)
N$8  (1 unrouted)
N$9  (1 unrouted)
N$10  (1 unrouted)
N$14  (1 unrouted)
N$15  (2 unrouted)
N$16  (1 unrouted)
N$19  (2 unrouted)
N$20  (2 unrouted)
N$21  (1 unrouted)
PITCH  (1 unrouted)
RESET  (5 unrouted)
RFN  (1 unrouted)
RFP  (1 unrouted)
ROLL  (1 unrouted)
SCK  (1 unrouted)
THROTTLE  (1 unrouted)
VBAT  (4 unrouted)
  pour Bottom (rank 2): 18,68.5 -2,68.5 -2,-5.5 54,-5.5 54,49 18,49
VREG3V3  (1 unrouted)
YAW  (1 unrouted)

### Text on the board
Top: Top Metal
Route2: Upper Inner Metal
Route15: Lower Inner Metal
Bottom: Bottom Metal
tPlace: GND | DTR | Ignore four drills outside of board area | Ignore four drills outside of board area | Quadremote-Mini / Mark IV | Rev 2 | GND | 3V3 | VBAT | VBUS | Steven Swanson | reset | on | off
Document: For 50 boards, this is $1.66/board